# Altium schematic sheet S1_POWER.SchDoc
size 431 x 279 mm; Revision: 1-0; SheetNumber: 2; SheetTotal: 4; CustomerName: PLASTIMOLD; .GlobalProjectCustomer: PLASTIMOLD; ProjectName: Chairspeaker TI Receiver
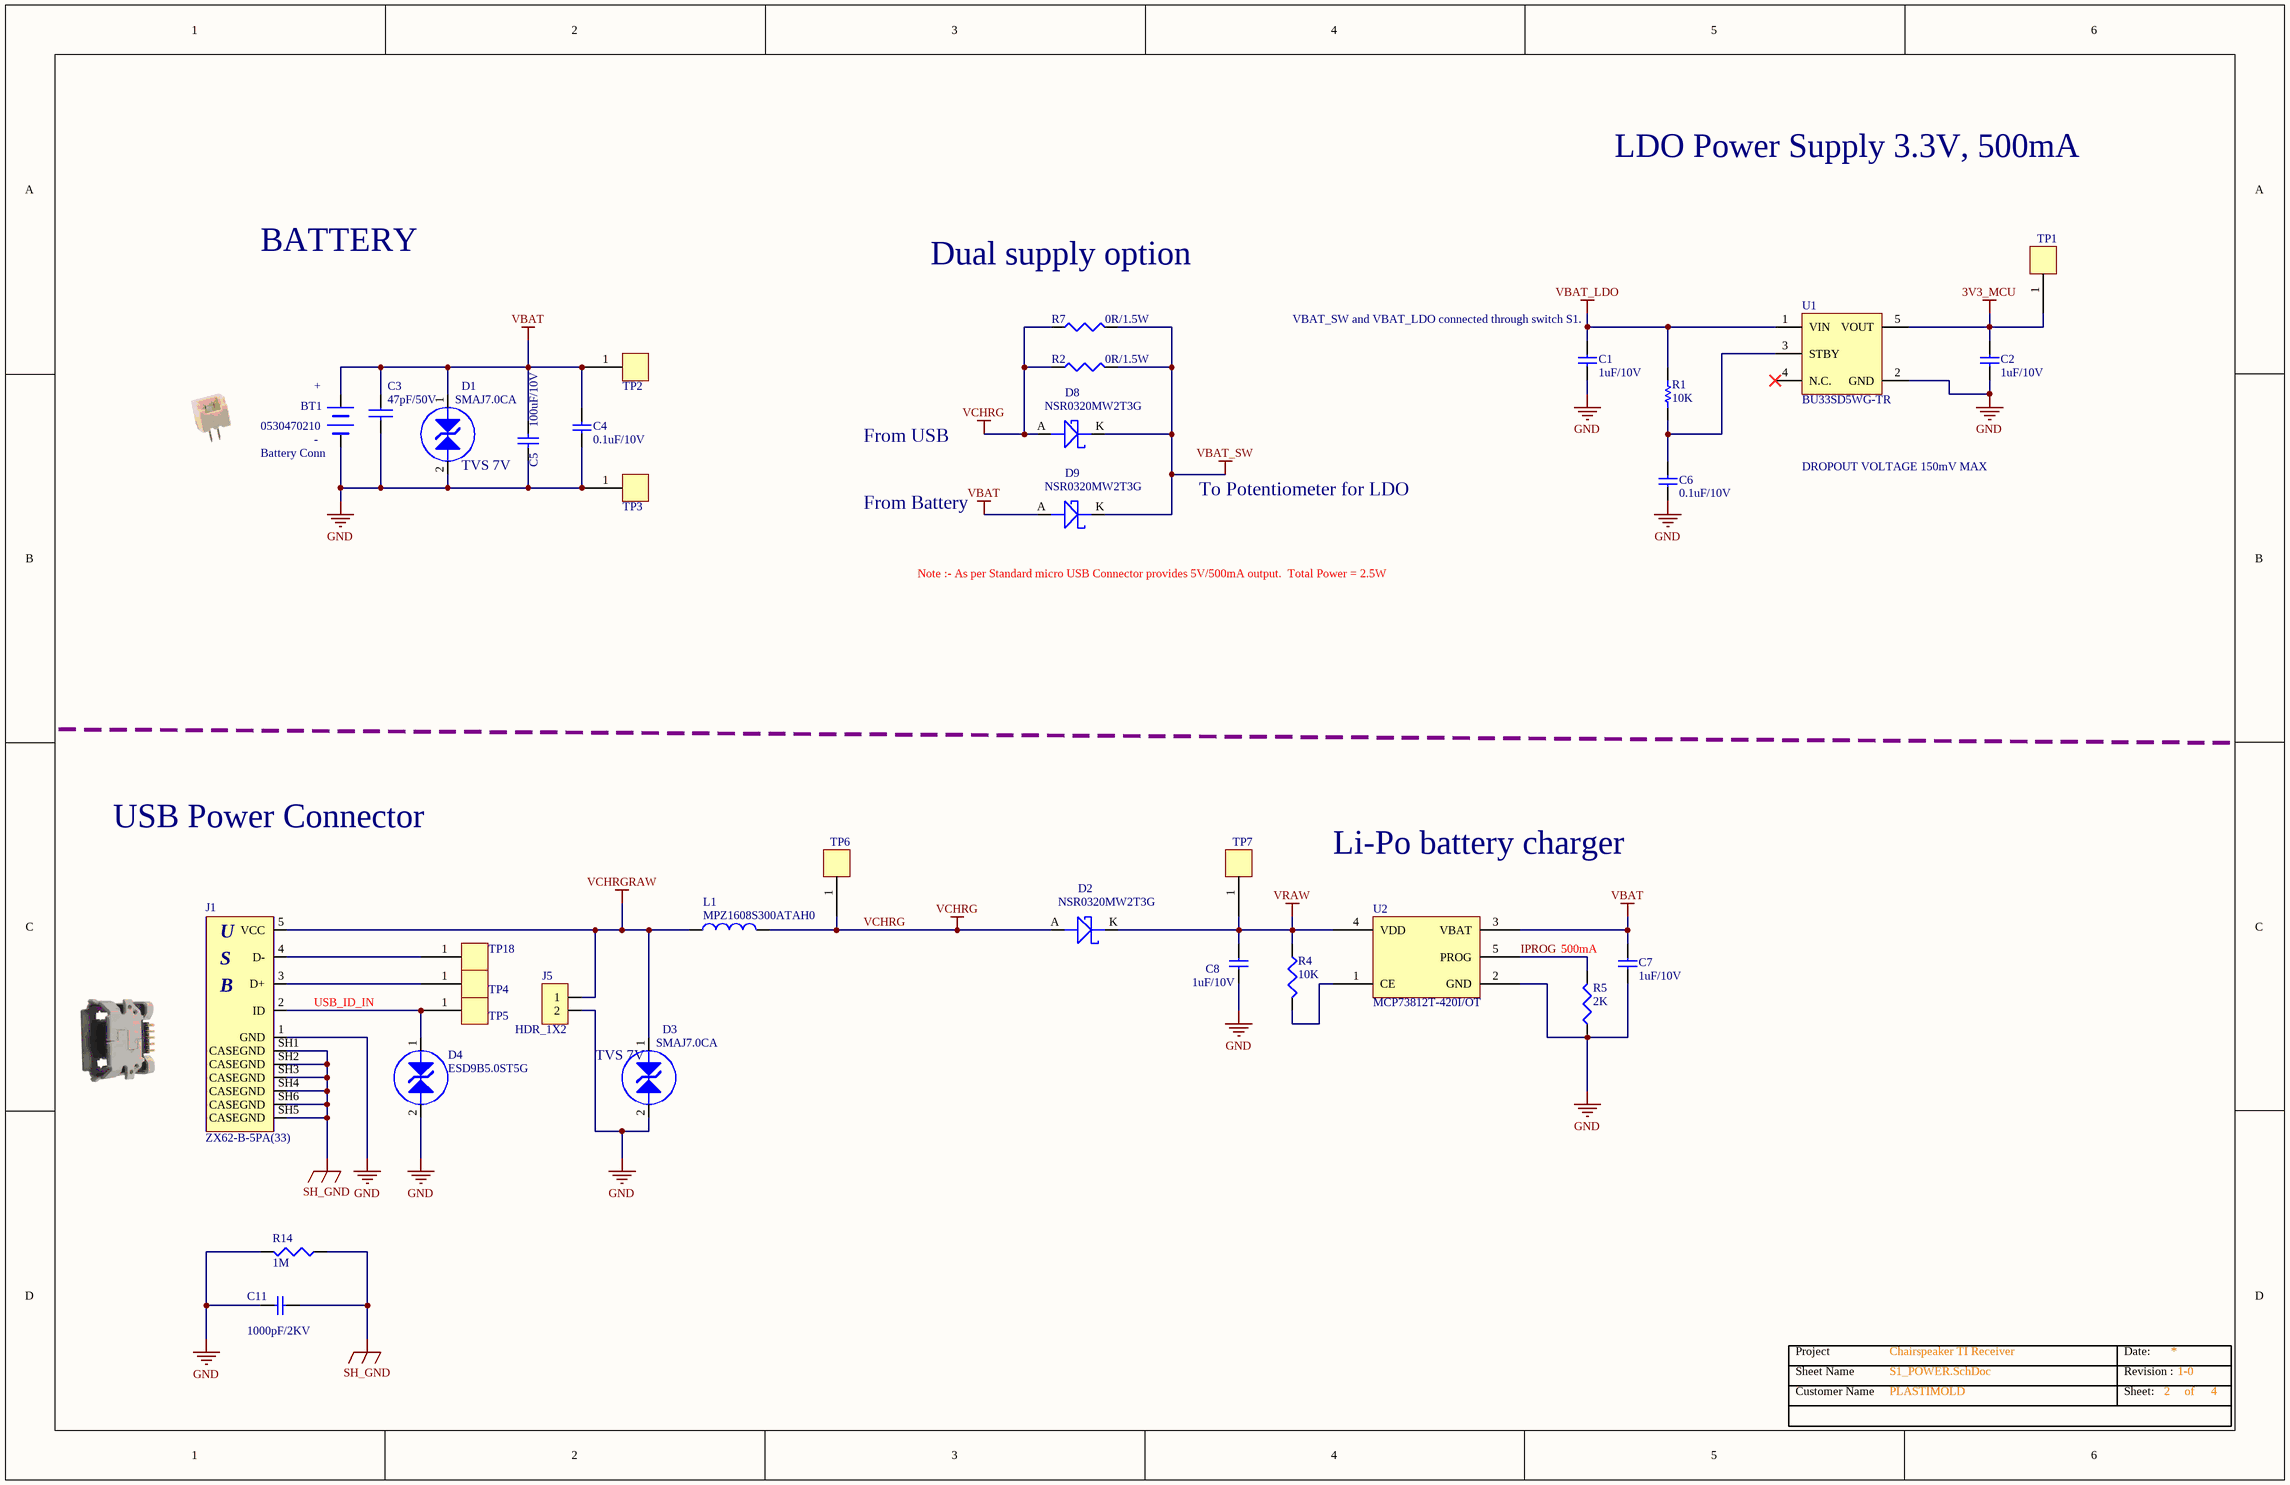
[diagram p0: S1_POWER.SchDoc]

## Parts
BT1  0530470210  [0530470210]
C1  1uF/10V  [CAP_0402_(M1005)]
C2  1uF/10V  [CAP_0402_(M1005)]
C3  47pF/50V  [CAP_0402_(M1005)]
C4  0.1uF/10V  [CAP_0402_(M1005)]
C5  100uF/10V  [CAP_1210_3225]
C6  0.1uF/10V  [CAP_0402_(M1005)]
C7  1uF/10V  [CAP_0402_(M1005)]
C8  1uF/10V  [CAP_0402_(M1005)]
C11  1000pF/2KV  [CAP_1206_(M3016)]
D1  SMAJ7.0CA  [DO-214AC (SMA)_BI_DIRECTION]
D2  NSR0320MW2T3G  [SOD-323]
D3  SMAJ7.0CA  [DO-214AC (SMA)_BI_DIRECTION]
D4  ESD9B5.0ST5G  [SOD-923-BI-DIRECTIONAL]
D8  NSR0320MW2T3G  [SOD-323]
D9  NSR0320MW2T3G  [SOD-323]
J1  ZX62-B-5PA(33)  [USB_MICRODBG]
J5  HDR_1X2  [HDR_1X2]
L1  MPZ1608S300ATAH0  [IND_0603_(M1608)]
R1  10K  [RES_0402_(M1005)]
R2  value 0R/1.5W  [RES_2512_(M6432)]  (hidden comment: 0R)
R4  10K  [RES_0402_(M1005)]
R5  2K  [RES_0402_(M1005)]
R7  value 0R/1.5W  [RES_2512_(M6432)]  (hidden comment: 0R)
R14  1M  [RES_0402_(M1005)]
TP1  TP  [TestP SM 30MIL ROUND]  (value not drawn)  (no BOM)
TP2  TP  [TestP SM 30MIL ROUND]  (value not drawn)  (no BOM)
TP3  TP  [TestP SM 30MIL ROUND]  (value not drawn)  (no BOM)
TP4  TP  [TestP SM 30MIL ROUND]  (value not drawn)  (no BOM)
TP5  TP  [TestP SM 30MIL ROUND]  (value not drawn)  (no BOM)
TP6  TP  [TestP SM 30MIL ROUND]  (value not drawn)  (no BOM)
TP7  TP  [TestP SM 30MIL ROUND]  (value not drawn)  (no BOM)
TP18  TP  [TestP SM 30MIL ROUND]  (value not drawn)  (no BOM)
U1  BU33SD5WG-TR  [SSOP5]
U2  MCP73812T-420I/OT  [SOT23-5]

## Nets
3V3_MCU: C2.2 TP1.1 U1.5(VOUT)
GND: BT1.1 C1.1 C2.1 C3.2 C4.2 C5.2 C6.2 C7.1 C8.1 C11.1 D1.2 D3.2 D4.2 J1.1(GND) J5.2 R5.1 R14.1 TP3.1 U1.2(GND) U2.2(GND)
SH_GND: C11.2 J1.SH1(CASEGND) J1.SH2(CASEGND) J1.SH3(CASEGND) J1.SH4(CASEGND) J1.SH5(CASEGND) J1.SH6(CASEGND) R14.2
VBAT: BT1.2 C3.1 C4.1 C5.1 C7.2 D1.1 D9.A(ANOD) TP2.1 U2.3(VBAT)
VBAT_LDO: C1.2 R1.1 U1.1(VIN)
VBAT_SW: D8.K(CATH) D9.K(CATH) R2.2 R7.2
VCHRG: D2.A(ANOD) D8.A(ANOD) L1.2 R2.1 R7.1 TP6.1
VCHRGRAW: D3.1 J1.5(VCC) J5.1 L1.1
VRAW: C8.2 D2.K(CATH) R4.1 TP7.1 U2.4(VDD)
IPROG: R5.2 U2.5(PROG)
USB_ID_IN: D4.1 J1.2(ID) TP5.1
NetC6_1: C6.1 R1.2 U1.3(STBY)
NetJ1_3: J1.3(D+) TP4.1
NetJ1_4: J1.4(D-) TP18.1
NetR4_2: R4.2 U2.1(CE)

Not connected (* = marked no-connect by the designer): U1 4(N.C.)*

## Notes on the sheet
- LDO Power Supply 3.3V, 500mA
- BATTERY
- Dual supply option
- (near C1) VBAT_SW and VBAT_LDO connected through switch S1.
- (near BT1) +
- (near BT1) Battery Conn
- (near BT1) -
- (near D1) TVS 7V
- From USB
- To Potentiometer for LDO
- DROPOUT VOLTAGE 150mV MAX
- From Battery
- Note :- As per Standard micro USB Connector provides 5V/500mA output.  Total Power = 2.5W
- USB Power Connector
- Li-Po battery charger
- 500mA
- (near D3) TVS 7V
- Sheet Name
- Project
- Date:
- Revision :
- Customer Name
- Sheet:
- of
- (in symbol CONN_USB_MINI_B) U; S; B

## Library data of the parts
BT1 = BATTERY: =Description1; pin to pad: 1>2 2>1; Manufacturer 1: Molex; Description1: CONN HEADER VERT 2POS 1.25MM; Cross Allowed: YES; Manufacturer Part Number 1: 0530470210; value: 0530470210
C1 C2 C7 C8 = CAP: =Description1; Manufacturer 1: Murata Electronics; Manufacturer Part Number 1: GRM155R61A105KE15D; Description1: CAP CER 1UF 10V X5R 0402; Cross Allowed: YES; Value: 1uF/10V
C3 = CAP NP: =Description1; Manufacturer 1: Yageo; Manufacturer Part Number 1: CC0402JRNPO9BN470; Description1: CAP CER 47PF 50V C0G/NPO 0402; Cross Allowed: YES; VALUE: 47pF/50V
C4 C6 = CAP: =Description1; Manufacturer 1: Yageo; Manufacturer Part Number 1: CC0402KRX7R6BB104; Description1: CAP CER 0.1UF 10V X7R 0402; Cross Allowed: YES; Value: 0.1uF/10V
C5 = C3216JB1A107M160AC: =Description1; Manufacturer Part Number 1: CL32A107MPVNNNE; Manufacturer 1: Samsung Electro-Mechanics; Description1: CAP CER 100UF 10V X5R 20% 1210; Cross Allowed: YES; Value: 100uF/10V
C11 = GRM155R61A104KA01D: =Description1; Manufacturer 1: KEMET; Manufacturer Part Number 1: C1206C102KGRACTU; Description1: CAP CER 1000PF 2KV X7R 1206; Cross Allowed: YES; Value: 1000pF/2KV
D1 D3 = TVS-DIODE: =Description1; Manufacturer 1: Littlefuse; Description1: TVS DIODE 7VWM 12VC SMA; Cross Allowed: NO; Manufacturer Part Number 1: SMAJ7.0CA; VALUE: SMAJ7.0CA
D2 D8 D9 = DIODE SCHOTTKY: =Description1; Manufacturer 1: ON Semiconductor; Description1: DIODE SCHOTTKY 20V 1A SOD323; Cross Allowed: NO; Manufacturer Part Number 1: NSR0320MW2T3G; Value: NSR0320MW2T3G
D4 = TVS-DIODE: =Description1; Manufacturer 1: ON Semiconductor; Description1: TVS DIODE 5V SOD923; Cross Allowed: NO; Manufacturer Part Number 1: ESD9B5.0ST5G; VALUE: ESD9B5.0ST5G
J1 = CONN_USB_MINI_B: =Description1; Manufacturer 1: Hirose; Description1: CONN RCPT MICRO USB B SMD R/A; Cross Allowed: YES; Manufacturer Part Number 1: ZX62-B-5PA(33); VALUE: ZX62-B-5PA(33)
J5 = HDR_1X2: =Description1; Manufacturer 1: Harwin Inc.; Manufacturer Part Number 1: M20-9990246; Cross Allowed: YES; Description1: CONN HEADER VERT 2POS 2.54MM; Value: HDR_1X2
L1 = FERRITE BEAD: =Description1; Manufacturer 1: TDK Corporation; Description1: FERRITE BEAD 30 OHM 0603 1LN; Cross Allowed: YES; Manufacturer Part Number 1: MPZ1608S300ATAH0; Value: MPZ1608S300ATAH0
R1 = RESISTOR: =Description1; Manufacturer 1: Stackpole Electronics Inc; Manufacturer Part Number 1: RMCF0402FT10K0; Description1: RES 10K OHM 1% 1/16W 0402; Cross Allowed: YES; Value: 10K
R2 R7 = RES_0R: =Description1; Manufacturer 1: Vishay Dale; Manufacturer Part Number 1: CRCW25120000Z0EGHP; Description1: RES SMD 0 OHM JUMPER 1.5W 2512; Cross Allowed: YES
R4 = RES: =Description1; Manufacturer 1: Stackpole Electronics Inc; Manufacturer Part Number 1: RMCF0402FT10K0; Description1: RES 10K OHM 1% 1/16W 0402; Cross Allowed: YES; VALUE: 10K
R5 = RES: =Description1; Manufacturer 1: Panasonic; Manufacturer Part Number 1: ERJ-2RKF2001X; Description1: RES SMD 2K OHM 1% 1/10W 0402; Cross Allowed: YES; Value: 2K
R14 = RES: =Description1; Manufacturer 1: Panasonic; Manufacturer Part Number 1: ERJ-2RKF1004X; Description1: RES SMD 1M OHM 1% 1/10W 0402; Cross Allowed: YES; Value: 1M
TP1-TP7 TP18 = TP: =Description1; Description1: NA; Value: NA; Cross Allowed: YES; Manufacturer 1: NA; Manufacturer Part Number 1: NA
U1 = BU33SD5WG-TR: =Description1; Manufacturer 1: Rohm Semiconductor; Description1: IC REG LINEAR 3.3V 500MA 5SSOP; Cross Allowed: NO; Manufacturer Part Number 1: BU33SD5WG-TR; Value: BU33SD5WG-TR
U2 = CHG_MCP73812: =Description1; Manufacturer 1: MICROCHIP; Description1: CHARGER IC LI-ION/LI-POLY SOT23-5; Cross Allowed: NO; Manufacturer Part Number 1: MCP73812T-420I/OT; VALUE: MCP73812T-420I/OT